# EAGLE schematic TwixBC_0.5 (EAGLE 5.06)

## Sheet 1 of 2
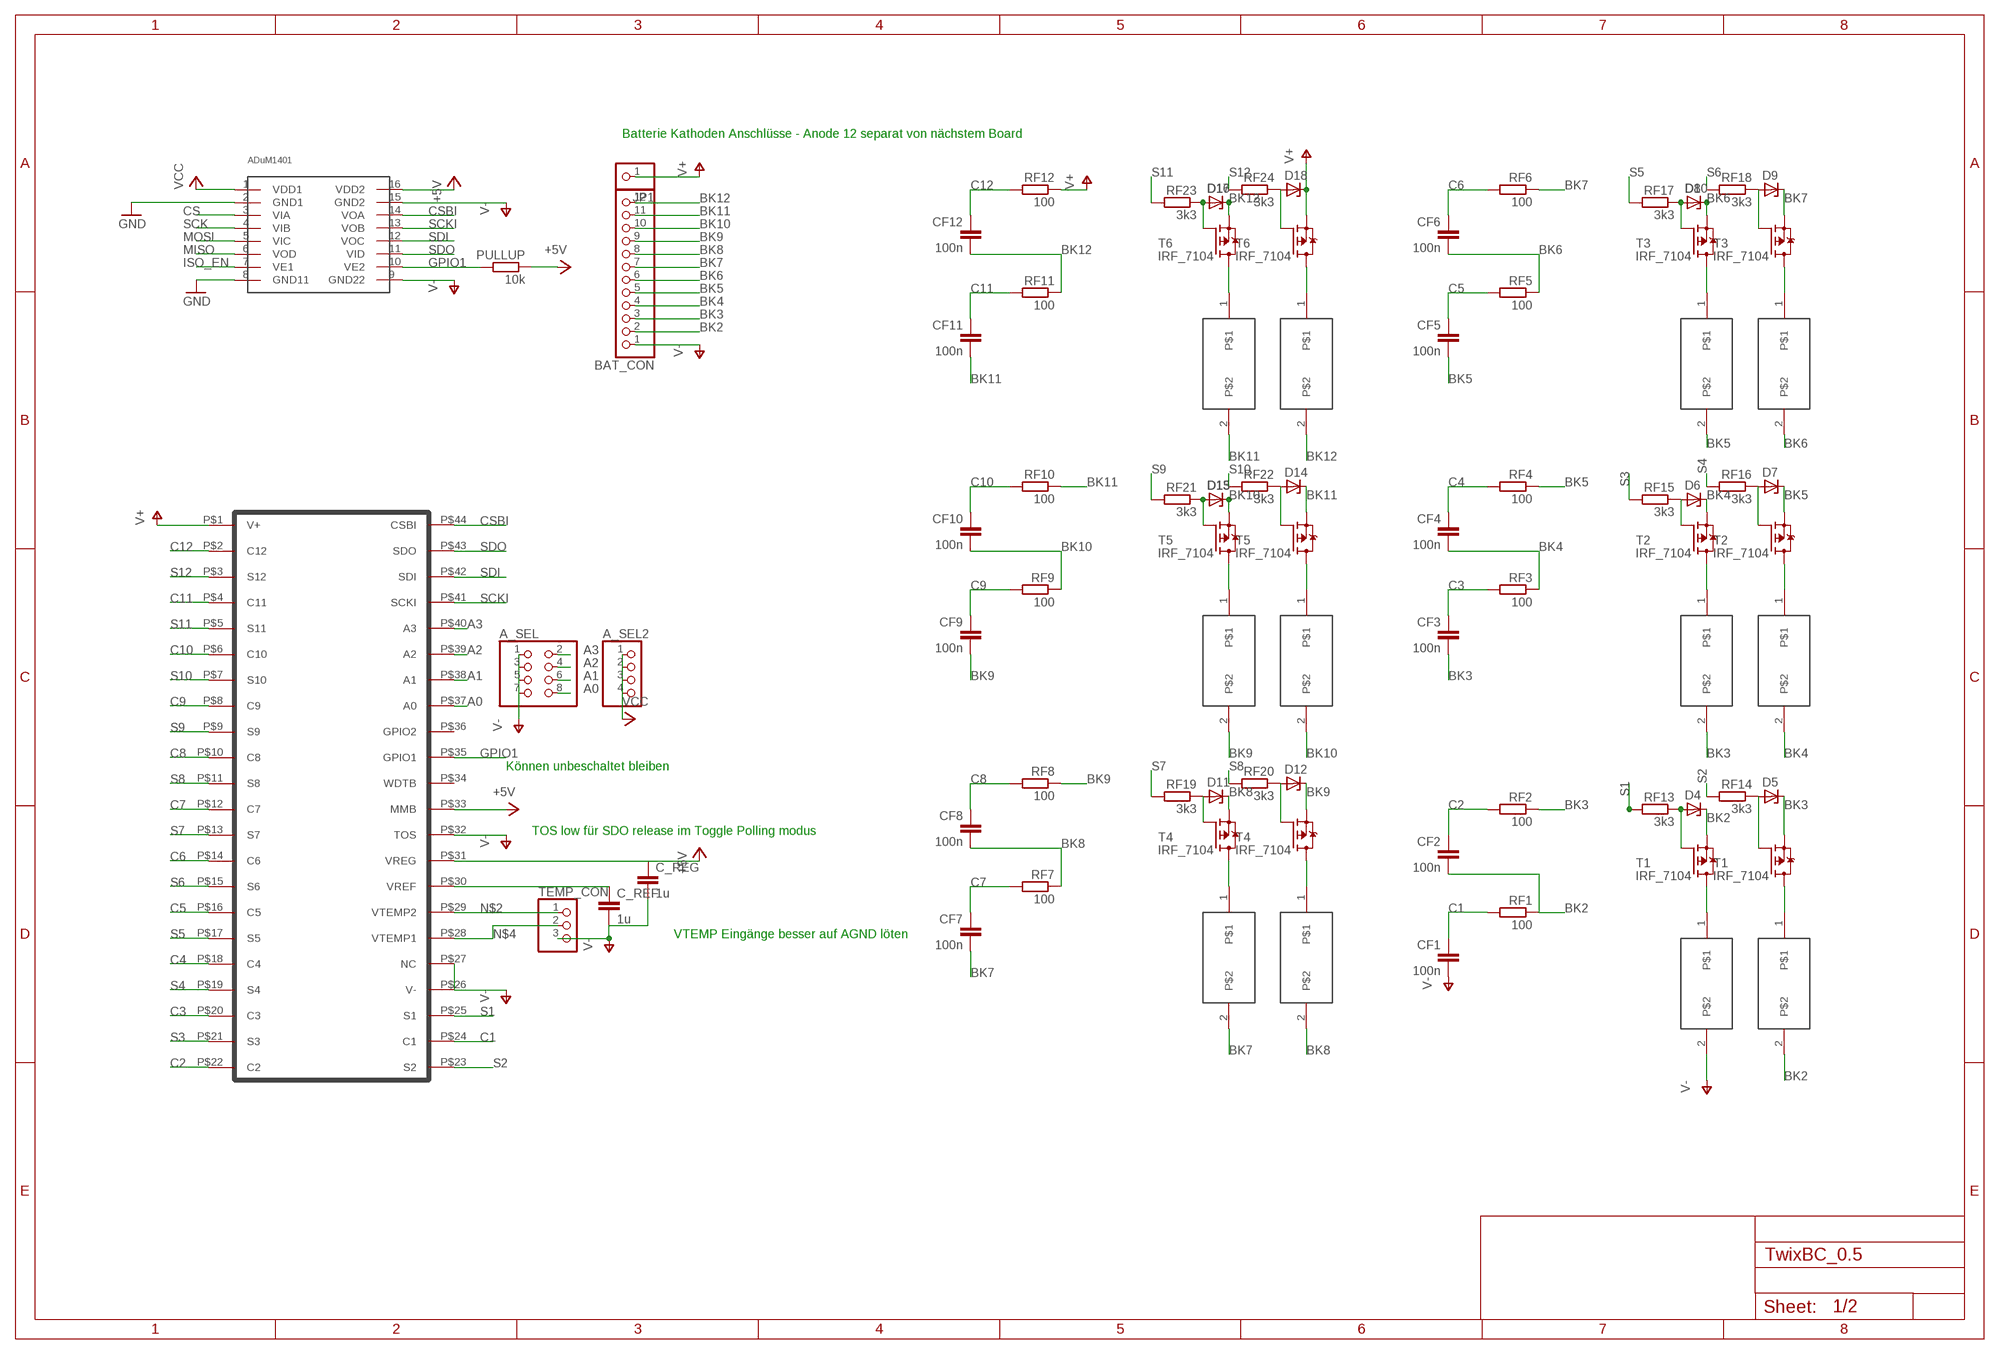
[diagram p0: schematic, sheet 1]

### Parts
A_SEL  PINHD-2X4  [2X04]
A_SEL2  PINHD-1X4  [1X04]
BAT_CON  PINHD-1X12  [1X12]
C_REF  1u  C-EUC1206  [C1206]
C_REG  1u  C-EUC1206  [C1206]
CF1  100n  C-EUC1206  [C1206]
CF2  100n  C-EUC1206  [C1206]
CF3  100n  C-EUC1206  [C1206]
CF4  100n  C-EUC1206  [C1206]
CF5  100n  C-EUC1206  [C1206]
CF6  100n  C-EUC1206  [C1206]
CF7  100n  C-EUC1206  [C1206]
CF8  100n  C-EUC1206  [C1206]
CF9  100n  C-EUC1206  [C1206]
CF10  100n  C-EUC1206  [C1206]
CF11  100n  C-EUC1206  [C1206]
CF12  100n  C-EUC1206  [C1206]
D4  ZENER-DIODESOD80C  [SOD80C]
D5  ZENER-DIODESOD80C  [SOD80C]
D6  ZENER-DIODESOD80C  [SOD80C]
D7  ZENER-DIODESOD80C  [SOD80C]
D8  ZENER-DIODESOD80C  [SOD80C]
D9  ZENER-DIODESOD80C  [SOD80C]
D10  ZENER-DIODESOD80C  [SOD80C]
D11  ZENER-DIODESOD80C  [SOD80C]
D12  ZENER-DIODESOD80C  [SOD80C]
D13  ZENER-DIODESOD80C  [SOD80C]
D14  ZENER-DIODESOD80C  [SOD80C]
D15  ZENER-DIODESOD80C  [SOD80C]
D16  ZENER-DIODESOD80C  [SOD80C]
D17  ZENER-DIODESOD80C  [SOD80C]
D18  ZENER-DIODESOD80C  [SOD80C]
JP1  PINHD-1X1  [1X01]
PULLUP  10k  R-EU_R1206  [R1206]
RF1  100  R-EU_R1206  [R1206]
RF2  100  R-EU_R1206  [R1206]
RF3  100  R-EU_R1206  [R1206]
RF4  100  R-EU_R1206  [R1206]
RF5  100  R-EU_R1206  [R1206]
RF6  100  R-EU_R1206  [R1206]
RF7  100  R-EU_R1206  [R1206]
RF8  100  R-EU_R1206  [R1206]
RF9  100  R-EU_R1206  [R1206]
RF10  100  R-EU_R1206  [R1206]
RF11  100  R-EU_R1206  [R1206]
RF12  100  R-EU_R1206  [R1206]
RF13  3k3  R-EU_R1206  [R1206]
RF14  3k3  R-EU_R1206  [R1206]
RF15  3k3  R-EU_R1206  [R1206]
RF16  3k3  R-EU_R1206  [R1206]
RF17  3k3  R-EU_R1206  [R1206]
RF18  3k3  R-EU_R1206  [R1206]
RF19  3k3  R-EU_R1206  [R1206]
RF20  3k3  R-EU_R1206  [R1206]
RF21  3k3  R-EU_R1206  [R1206]
RF22  3k3  R-EU_R1206  [R1206]
RF23  3k3  R-EU_R1206  [R1206]
RF24  3k3  R-EU_R1206  [R1206]
RL1  R_5W  [R_5W]
RL2  R_5W  [R_5W]
RL3  R_5W  [R_5W]
RL4  R_5W  [R_5W]
RL5  R_5W  [R_5W]
RL6  R_5W  [R_5W]
RL7  R_5W  [R_5W]
RL8  R_5W  [R_5W]
RL9  R_5W  [R_5W]
RL10  R_5W  [R_5W]
RL11  R_5W  [R_5W]
RL12  R_5W  [R_5W]
T1  IRF_7104  [SO8]
T2  IRF_7104  [SO8]
T3  IRF_7104  [SO8]
T4  IRF_7104  [SO8]
T5  IRF_7104  [SO8]
T6  IRF_7104  [SO8]
TEMP_CON  PINHD-1X3  [1X03]
U$1  LTC6802-2  [SSOP48]
U$3  ADUM1401  [SO16]

### Nets
+5V: C_REG.1 PULLUP.1 U$1.P$31(VREG) U$1.P$33(MMB) U$3.16(VDD2)
A0: A_SEL.8 U$1.P$37(A0)
A1: A_SEL.6 U$1.P$38(A1)
A2: A_SEL.4 U$1.P$39(A2)
A3: A_SEL.2 U$1.P$40(A3)
ASD: RL5.1 T3.7(D2)
BK2: BAT_CON.2 CF2.2 D4.C RF1.1 RL2.2 T1.1(S2)
BK3: BAT_CON.3 CF3.2 D5.C RF2.1 RL3.2 T1.3(S1)
BK4: BAT_CON.4 CF4.2 D6.C RF3.1 RL4.2 T2.1(S2)
BK5: BAT_CON.5 CF5.2 D7.C RF4.1 RL5.2 T2.3(S1)
BK6: BAT_CON.6 CF6.2 D8.C D10.C RF5.1 RL6.2 T3.1(S2)
BK7: BAT_CON.7 CF7.2 D9.C RF6.1 RL7.2 T3.3(S1)
BK8: BAT_CON.8 CF8.2 D11.C RF7.1 RL8.2 T4.1(S2)
BK9: BAT_CON.9 CF9.2 D12.C RF8.1 RL9.2 T4.3(S1)
BK10: BAT_CON.10 CF10.2 D13.C D15.C RF9.1 RL10.2 T5.1(S2)
BK11: BAT_CON.11 CF11.2 D14.C RF10.1 RL11.2 T5.3(S1)
BK12: BAT_CON.12 CF12.2 D16.C D17.C RF11.1 RL12.2 T6.1(S2)
C1: CF1.1 RF1.2 U$1.P$24(C1)
C2: CF2.1 RF2.2 U$1.P$22(C2)
C3: CF3.1 RF3.2 U$1.P$20(C3)
C4: CF4.1 RF4.2 U$1.P$18(C4)
C5: CF5.1 RF5.2 U$1.P$16(C5)
C6: CF6.1 RF6.2 U$1.P$14(C6)
C7: CF7.1 RF7.2 U$1.P$12(C7)
C8: CF8.1 RF8.2 U$1.P$10(C8)
C9: CF9.1 RF9.2 U$1.P$8(C9)
C10: CF10.1 RF10.2 U$1.P$6(C10)
C11: CF11.1 RF11.2 U$1.P$4(C11)
C12: CF12.1 RF12.2 U$1.P$2(C12)
CS: U$3.3(VIA) ; also sheet 2
CSBI: U$1.P$44(CSBI) U$3.14(VOA)
GND: U$3.2(GND1) U$3.8(GND11) ; also sheet 2
GPIO1: PULLUP.2 U$1.P$35(GPIO1) U$3.10(VE2)
ISO_EN: U$3.7(VE1) ; also sheet 2
MISO: U$3.6(VOD) ; also sheet 2
MOSI: U$3.5(VIC) ; also sheet 2
N$2: TEMP_CON.1 U$1.P$29(VTEMP2)
N$3: C_REF.1 U$1.P$30(VREF)
N$4: TEMP_CON.2 U$1.P$28(VTEMP1)
N$5: RL3.1 T2.7(D2)
N$6: RL4.1 T2.5(D1)
N$8: RL1.1 T1.7(D2)
N$9: RL2.1 T1.5(D1)
N$10: RL6.1 T3.5(D1)
N$11: RL7.1 T4.7(D2)
N$12: RL8.1 T4.5(D1)
N$13: RL9.1 T5.7(D2)
N$14: RL10.1 T5.5(D1)
N$15: RL11.1 T6.7(D2)
N$16: RL12.1 T6.5(D1)
N$17: D4.A RF13.1 T1.2(G2)
N$23: D5.A RF14.1 T1.4(G1)
N$55: D6.A RF15.1 T2.2(G2)
N$56: D7.A RF16.1 T2.4(G1)
N$57: D8.A D10.A RF17.1 T3.2(G2)
N$58: D11.A RF19.1 T4.2(G2)
N$59: D9.A RF18.1 T3.4(G1)
N$60: D12.A RF20.1 T4.4(G1)
N$61: D13.A D15.A RF21.1 T5.2(G2)
N$62: D14.A RF22.1 T5.4(G1)
N$63: D16.A D17.A RF23.1 T6.2(G2)
N$64: D18.A RF24.1 T6.4(G1)
S1: RF13.2 U$1.P$25(S1)
S2: RF14.2 U$1.P$23(S2)
S3: RF15.2 U$1.P$21(S3)
S4: RF16.2 U$1.P$19(S4)
S5: RF17.2 U$1.P$17(S5)
S6: RF18.2 U$1.P$15(S6)
S7: RF19.2 U$1.P$13(S7)
S8: RF20.2 U$1.P$11(S8)
S9: RF21.2 U$1.P$9(S9)
S10: RF22.2 U$1.P$7(S10)
S11: RF23.2 U$1.P$5(S11)
S12: RF24.2 U$1.P$3(S12)
SCK: U$3.4(VIB) ; also sheet 2
SCKI: U$1.P$41(SCKI) U$3.13(VOB)
SDI: U$1.P$42(SDI) U$3.12(VOC)
SDO: U$1.P$43(SDO) U$3.11(VID)
V+: D18.C JP1.1 RF12.1 T6.3(S1) U$1.P$1(V+)
V-: A_SEL.1 A_SEL.3 A_SEL.5 A_SEL.7 BAT_CON.1 C_REF.2 C_REG.2 CF1.2 RL1.2 TEMP_CON.3 U$1.P$26(V-) U$1.P$27(NC) U$1.P$32(TOS) U$3.9(GND22) U$3.15(GND2)
VCC: A_SEL2.1 A_SEL2.2 A_SEL2.3 A_SEL2.4 U$3.1(VDD1) ; also sheet 2
Unconnected: U$1.P$34(WDTB) U$1.P$36(GPIO2)

### Notes on the sheet
- Batterie Kathoden Anschlüsse - Anode 12 separat von nächstem Board
- Können unbeschaltet bleiben
- TOS low für SDO release im Toggle Polling modus
- VTEMP Eingänge besser auf AGND löten

## Sheet 2 of 2
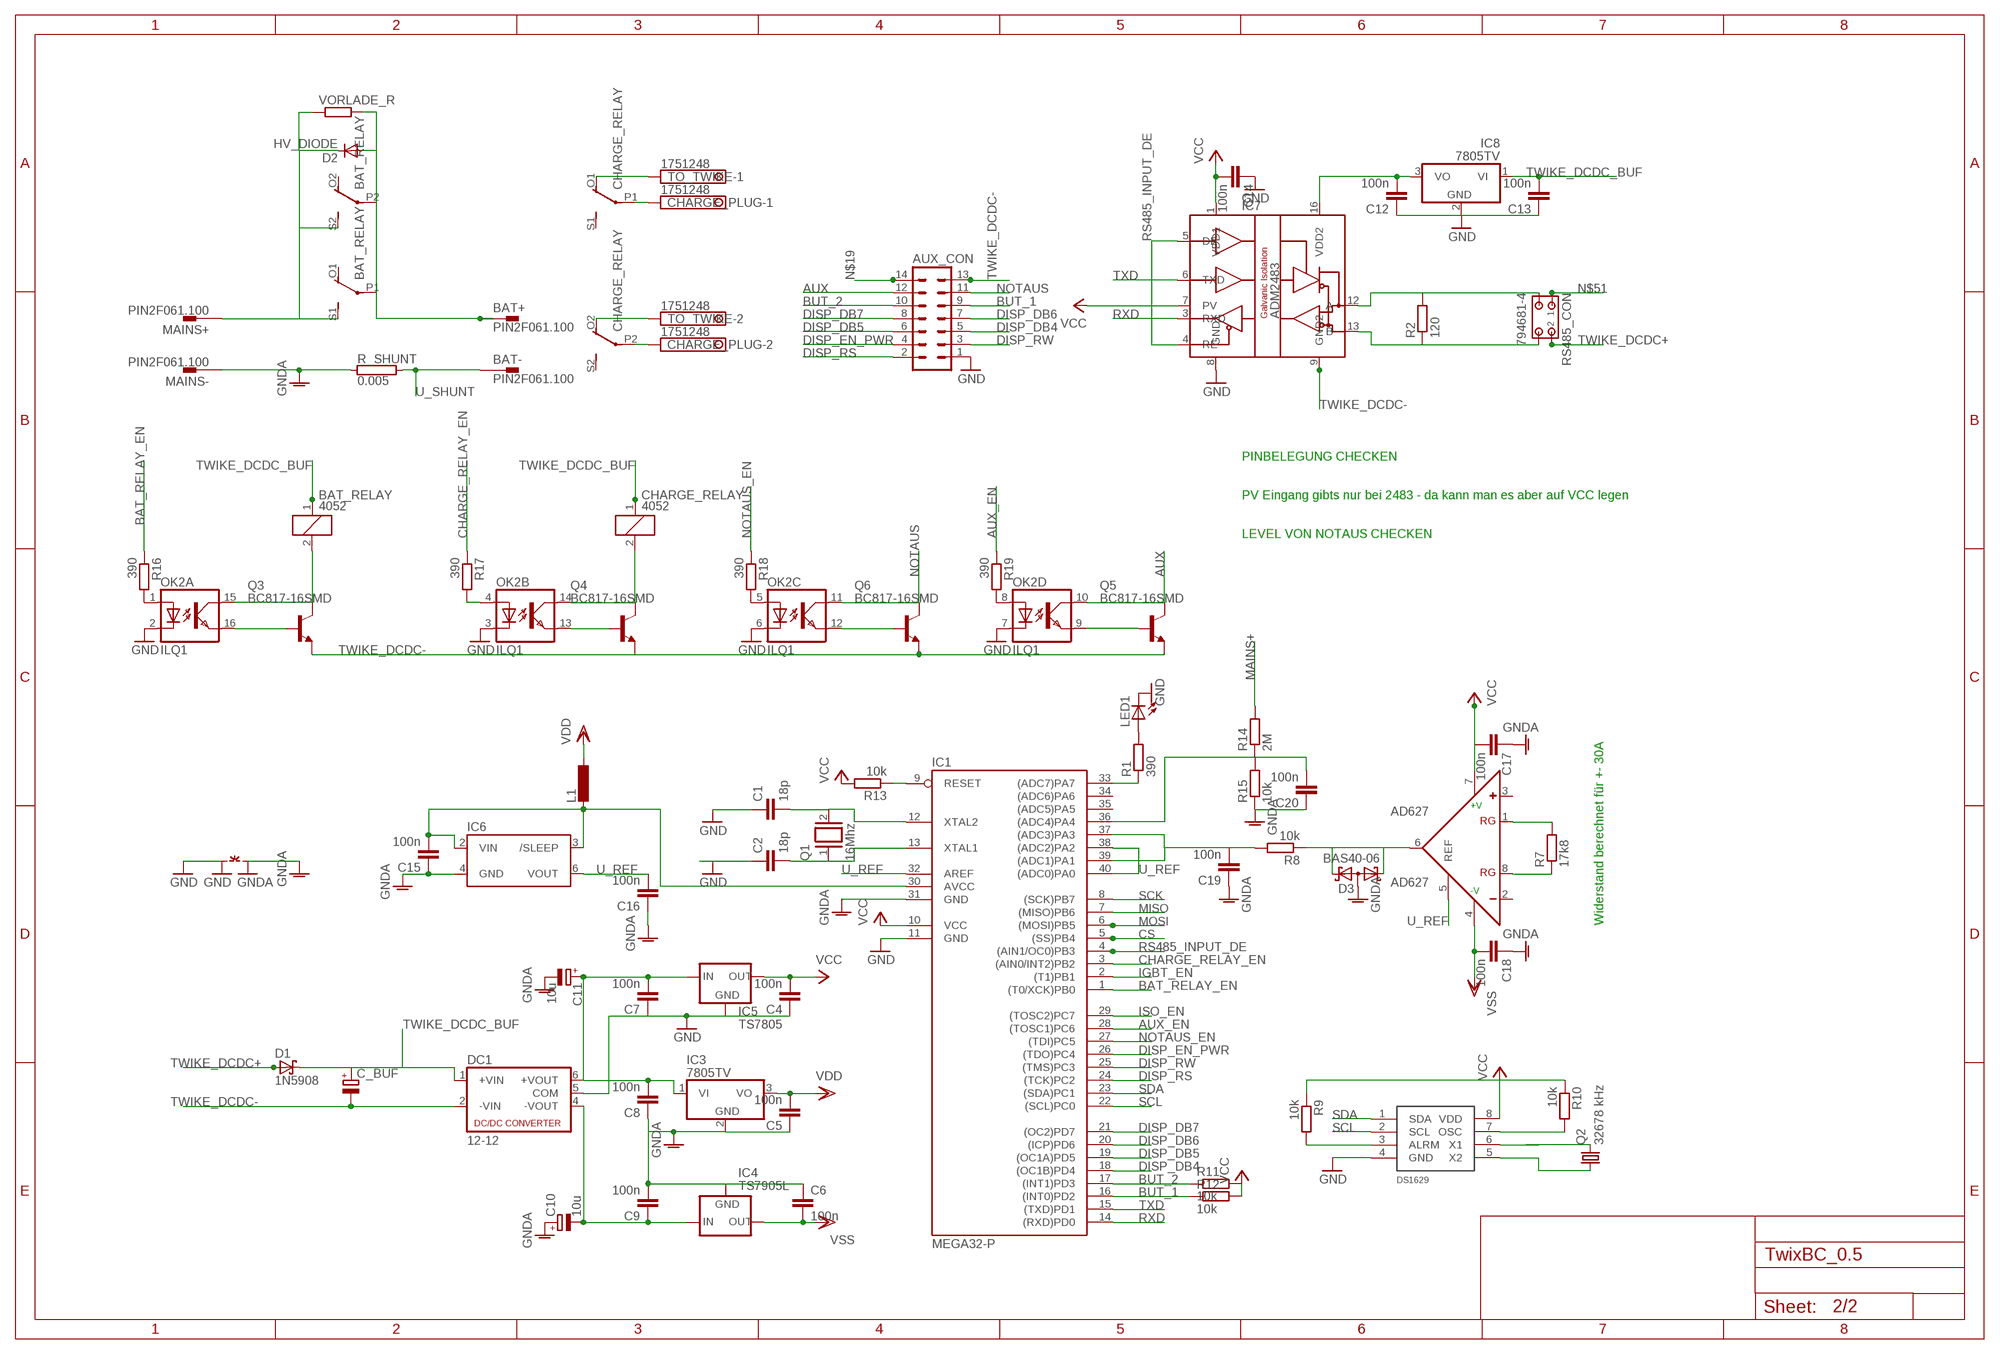
[diagram p1: schematic, sheet 2]

### Parts
AD627  AD627  AD620N  [DIL08]
AUX_CON  ML14  [ML14]
BAT+  PIN2F061.100  [F061.100]
BAT-  PIN2F061.100  [F061.100]
BAT_RELAY  4052  [F4052]
C1  18p  C-EUC1206  [C1206]
C2  18p  C-EUC1206  [C1206]
C4  100n  C-EUC1206  [C1206]
C5  100n  C-EUC1206  [C1206]
C6  100n  C-EUC1206  [C1206]
C7  100n  C-EUC1206  [C1206]
C8  100n  C-EUC1206  [C1206]
C9  100n  C-EUC1206  [C1206]
C10  10u  CPOL-EUE2.5-5  [E2,5-5]
C11  10u  CPOL-EUE2.5-5  [E2,5-5]
C12  100n  C-EUC1206  [C1206]
C13  100n  C-EUC1206  [C1206]
C14  100n  C-EUC1206  [C1206]
C15  100n  C-EUC1206  [C1206]
C16  100n  C-EUC1206  [C1206]
C17  100n  C-EUC1206  [C1206]
C18  100n  C-EUC1206  [C1206]
C19  100n  C-EUC1206  [C1206]
C20  100n  C-EUC1206  [C1206]
C_BUF  CPOL-EUE7.5-18  [E7,5-18]
CHARGE_PLUG  1751248  [1751248]
CHARGE_RELAY  4052  [F4052]
D1  1N5908  [C4111-15]
D2  HV_DIODE  UF5400  [DO201-15]
D3  BAS40-06  [SOT23]
DC1  12-12  NMA  [NMA]
IC1  MEGA32-P  [DIL40]
IC3  7805TV  [TO220V]
IC4  TS7905L  79XXL  [79XXL]
IC5  TS7805  78XXS  [78XXS]
IC6  REF192  [SO08]
IC7  ADM2483  [SO16W]
IC8  7805TV  [TO220V]
L1  L-EUL3225M  [L3225M]
LED1  LEDCHIP-LED0805  [CHIP-LED0805]
MAINS+  PIN2F061.100  [F061.100]
MAINS-  PIN2F061.100  [F061.100]
OK2  ILQ1  [DIL16]
Q1  16Mhz  XTAL  [Q]
Q2  32678 kHz  CRYSTALTC26V  [TC26V]
Q3  BC817-16SMD  [SOT23-BEC]
Q4  BC817-16SMD  [SOT23-BEC]
Q5  BC817-16SMD  [SOT23-BEC]
Q6  BC817-16SMD  [SOT23-BEC]
R1  390  R-EU_M1206  [M1206]
R2  120  R-EU_M1206  [M1206]
R7  17k8  R-EU_M1206  [M1206]
R8  10k  R-EU_M1206  [M1206]
R9  10k  R-EU_M1206  [M1206]
R10  10k  R-EU_M1206  [M1206]
R11  10k  R-EU_M1206  [M1206]
R12  10k  R-EU_M1206  [M1206]
R13  10k  R-EU_M1206  [M1206]
R14  2M  R-EU_MELF0207W  [MINI_MELF-0207W]
R15  10k  R-EU_MELF0207W  [MINI_MELF-0207W]
R16  390  R-EU_M1206  [M1206]
R17  390  R-EU_M1206  [M1206]
R18  390  R-EU_M1206  [M1206]
R19  390  R-EU_M1206  [M1206]
R_SHUNT  0.005  RKH208-8  [KH208-8]
RS485_CON  794681-4  [794681-4]
TO_TWIKE  1751248  [1751248]
U$2  DS1629  [S08]
VORLADE_R  R-EU_RDH/15  [RDH/15]
~NUDEV~1  GND-GNDA  [GND-GNDA]

### Nets
AUX: AUX_CON.12 OK2.10(D:COL) Q5.C
AUX_EN: IC1.28((TOSC1)PC6) R19.1
BAT_RELAY_EN: IC1.1((T0/XCK)PB0) R16.1
BUT_1: AUX_CON.9 IC1.16((INT0)PD2) R12.1
BUT_2: AUX_CON.10 IC1.17((INT1)PD3) R11.1
CHARGE_RELAY_EN: IC1.3((AIN0/INT2)PB2) R17.1
CS: IC1.5((SS)PB4) ; also sheet 1
DISP_DB4: AUX_CON.5 IC1.18((OC1B)PD4)
DISP_DB5: AUX_CON.6 IC1.19((OC1A)PD5)
DISP_DB6: AUX_CON.7 IC1.20((ICP)PD6)
DISP_DB7: AUX_CON.8 IC1.21((OC2)PD7)
DISP_EN_PWR: AUX_CON.4 IC1.26((TDO)PC4)
DISP_RS: AUX_CON.2 IC1.24((TCK)PC2)
DISP_RW: AUX_CON.3 IC1.25((TMS)PC3)
GND: AUX_CON.1 C1.1 C4.1 C7.1 C12.1 C13.1 C14.1 DC1.5(COM) IC1.11(GND) IC5.GND IC7.8(GND1) IC8.2(GND) LED1.C OK2.2(A:C) OK2.3(B:C) OK2.6(C:C) OK2.7(D:C) U$2.4(GND) ~NUDEV~1.GND ; also sheet 1
GNDA: C5.1 C6.1 C8.1 C9.2 C10.+ C11.- C15.1 C16.1 C17.1 C18.1 C19.1 C20.1 D3.3(AA) IC1.31(GND) IC3.2(GND) IC4.GND IC6.4(GND) MAINS-.A1 R15.1 R_SHUNT.1 ~NUDEV~1.GNDA
IGBT_EN: IC1.2((T1)PB1)
ISO_EN: IC1.29((TOSC2)PC7) ; also sheet 1
MAINS+: BAT_RELAY.S1(2:S) BAT_RELAY.S2(3:S) D2.C MAINS+.A1 R14.2 VORLADE_R.1
MISO: IC1.7((MISO)PB6) ; also sheet 1
MOSI: IC1.6((MOSI)PB5) ; also sheet 1
N$1: IC1.33((ADC7)PA7) R1.1
N$7: C2.1
N$18: C1.2 IC1.12(XTAL2) Q1.2
N$19: AUX_CON.14
N$22: C2.2 IC1.13(XTAL1) Q1.1
N$24: BAT+.A1 BAT+.A2(1.1) BAT_RELAY.P1(2:P) BAT_RELAY.P2(3:P) D2.A VORLADE_R.2
N$25: BAT_RELAY.2 OK2.15(A:COL) Q3.C
N$26: IC7.12(A) R2.2 RS485_CON.3
N$27: IC7.13(B) R2.1 RS485_CON.4
N$28: C12.2 IC7.16(VDD2) IC8.3(VO)
N$29: C15.2 IC1.30(AVCC) IC6.2(VIN) IC6.3(/SLEEP) L1.2
N$30: AD627.6(OUT) D3.1(K1) D3.2(K2) R8.1
N$31: C7.2 C8.2 C11.+ DC1.6(+VOUT) IC3.1(VI) IC5.IN
N$32: C9.1 C10.- DC1.4(-VOUT) IC4.IN
N$33: AD627.1(RG) R7.2
N$34: AD627.8(RG) R7.1
N$35: C19.2 IC1.37((ADC3)PA3) IC1.39((ADC1)PA1) R8.2
N$36: R10.2 U$2.7(OSC)
N$37: R9.2 U$2.3(ALRM)
N$38: IC1.9(RESET) R13.1
N$39: C20.2 IC1.36((ADC4)PA4) R14.1 R15.2
N$40: Q2.2 U$2.6(X1)
N$41: Q2.1 U$2.5(X2)
N$42: OK2.16(A:EMIT) Q3.B
N$43: OK2.1(A:A) R16.2
N$44: OK2.4(B:A) R17.2
N$45: CHARGE_PLUG.1 CHARGE_RELAY.P1(2:P)
N$46: CHARGE_PLUG.2 CHARGE_RELAY.P2(3:P)
N$47: CHARGE_RELAY.2 OK2.14(B:COL) Q4.C
N$48: CHARGE_RELAY.O1(2:O) TO_TWIKE.1
N$49: CHARGE_RELAY.O2(3:O) TO_TWIKE.2
N$50: OK2.5(C:A) R18.2
N$51: RS485_CON.1
N$52: OK2.8(D:A) R19.2
N$53: LED1.A R1.2
N$54: OK2.9(D:EMIT) Q5.B
N$65: OK2.12(C:EMIT) Q6.B
NOTAUS: AUX_CON.11 OK2.11(C:COL) Q6.C
NOTAUS_EN: IC1.27((TDI)PC5) R18.1
RS485_INPUT_DE: IC1.4((AIN1/OC0)PB3) IC7.4(RE) IC7.5(DE)
RXD: IC1.14((RXD)PD0) IC7.3(RXD)
SCK: IC1.8((SCK)PB7) ; also sheet 1
SCL: IC1.22((SCL)PC0) U$2.2(SCL)
SDA: IC1.23((SDA)PC1) U$2.1(SDA)
TWIKE_DCDC+: D1.A RS485_CON.2
TWIKE_DCDC-: AUX_CON.13 C_BUF.- DC1.2(-VIN) IC7.9(GND2) OK2.13(B:EMIT) Q3.E Q4.B Q4.E Q5.E Q6.E
TWIKE_DCDC_BUF: BAT_RELAY.1 C13.2 C_BUF.+ CHARGE_RELAY.1 D1.C DC1.1(+VIN) IC8.1(VI)
TXD: IC1.15((TXD)PD1) IC7.6(TXD)
U_REF: AD627.5(REF) C16.2 IC1.32(AREF) IC1.38((ADC2)PA2) IC1.40((ADC0)PA0) IC6.6(VOUT)
U_SHUNT: BAT-.A1 R_SHUNT.2
VCC: AD627.7(+V) C4.2 C14.2 C17.2 IC1.10(VCC) IC5.OUT IC7.1(VDD1) IC7.7(PV) R9.1 R10.1 R11.2 R12.2 R13.2 U$2.8(VDD) ; also sheet 1
VDD: C5.2 IC3.3(VO) L1.1
VSS: AD627.4(-V) C6.2 C18.2 IC4.OUT
Unconnected: AD627.2(-) AD627.3(+) BAT-.A2(1.1) BAT_RELAY.O1(2:O) BAT_RELAY.O2(3:O) CHARGE_RELAY.S1(2:S) CHARGE_RELAY.S2(3:S) IC1.34((ADC6)PA6) IC1.35((ADC5)PA5) MAINS+.A2(1.1) MAINS-.A2(1.1)

### Notes on the sheet
- PINBELEGUNG CHECKEN
- PV Eingang gibts nur bei 2483 - da kann man es aber auf VCC legen
- LEVEL VON NOTAUS CHECKEN
- Widerstand berechnet für +- 30A

## Library data of the parts
A_SEL = pinhead:PINHD-2X4: PIN HEADER
A_SEL2 = pinhead:PINHD-1X4: PIN HEADER
AD627 = analog-devices:AD620: Low Cost, Low Power, Instrumentation Amplifier Source: http://www.analog.com/UploadedFiles/Data_Sheets/37793330023930AD620_e.pdf
AUX_CON = con-ml:ML14: HARTING
BAT+ BAT- MAINS+ MAINS- = con-faston:PIN2: Flachstecker Typ Tyco/Electronics/AMP TAB, FASTON Printed Circuit Board Tabs Source: http://www.buerklin.com, http://catalog.tycoelectronics.com
BAT_CON = pinhead:PINHD-1X12: PIN HEADER
BAT_RELAY CHARGE_RELAY = relay:4052: RELAY 2 x switch, Finder
C1 C2 C4-C9 C12-C20 C_REF C_REG CF1-CF12 = rcl:C-EU: CAPACITOR, European symbol
C10 C11 C_BUF = rcl:CPOL-EU: POLARIZED CAPACITOR, European symbol
CHARGE_PLUG TO_TWIKE = con-phoenix-350:1751248: MKDS 1/ 2-3,5 Printklemme Nennstrom: 10 A Bemessungsspannung: 160 V Raster: 3,5 mm Polzahl: 2 Montageart: Löten Anschlussart: Schraubanschluss Anschlussrichtung vom Leiter zur Platine: 0° Source: http://eshop.phoenixcontact.com .. 1751248.pdf
D1 = diode:1N5908: DIODE schottky
D2 = diode:UF5400: DIODE ultra fast rectifier, 3 A
D3 = diode:BAS40-06: Silicon Schottky Diodes General-purpose diode for high-speed switching
D4-D18 = diode:ZENER-DIODE: Z-Diode
DC1 = dc-dc-converter:NMA: DC-DC CONVERTER
IC1 = atmel:MEGA32-P: MICROCONTROLLER 32 Kbytes FLASH 2 Kbytes SRAM 1 Kbytes EEPROM USART 8-channel 10 bit ADC Source: www.atmel.com .. doc2503.pdf
IC3 IC8 = linear:78*: Positive VOLTAGE REGULATOR Source: http://cache.national.com/ds/LM/LM78L05.pdf http://www.fairchildsemi.com/ds/LM/LM7805.pdf
IC4 = v-reg:79XXL: VOLTAGE REGULATOR
IC5 = v-reg:78XXS: VOLTAGE REGULATOR
IC6 = Libs_Markus:REF192
IC7 = Libs_Markus:ADM2483: RS-485 Transceiver, iCoupler® Isolated, Half-Duplex
JP1 = pinhead:PINHD-1X1: PIN HEADER
L1 = rcl:L-EU: INDUCTOR, European symbol
LED1 = led:LED: LED OSRAM: - CHIPLED LG R971, LG N971, LY N971, LG Q971, LY Q971, LO R971, LY R971 LH N974, LH R974 LS Q976, LO Q976, LY Q976 LO Q996 - Hyper CHIPLED LW Q18S LB Q993, LB Q99A, LB R99A - SideLED LS A670, LO A670, LY A670, LG A670, LP A670 LB A673, LV A673, LT A673, LW A673 LH A674 LY A675 LS A676, LA A676, LO A676, LY A676, LW A676 LS A679, LY A679, LG A679 - Hyper Micro SIDELED® LS Y876, LA Y876, LO Y876, LY Y876 LT Y87S - SmartLED LW L88C, LW L88S LB L89C, LB L89S, LG L890 LS L89K, LO L89K, LY L89K LS L896, LA L896, LO L896, LY L896 - TOPLED LS T670, LO T670, LY T670, LG T670, LP T670 LSG T670, LSP T670, LSY T670, LOP T670, LYG T670 LG T671, LOG T671, LSG T671 LB T673, LV T673, LT T673, LW T673 LH T674 LS T676, LA T676, LO T676, LY T676, LB T676, LH T676, LSB T676, LW T676 LB T67C, LV T67C, LT T67C, LS T67K, LO T67K, LY T67K, LW E67C LS E67B, LA E67B, LO E67B, LY E67B, LB E67C, LV E67C, LT E67C LW T67C LS T679, LY T679, LG T679 LS T770, LO T770, LY T770, LG T770, LP T770 LB T773, LV T773, LT T773, LW T773 LH T774 LS E675, LA E675, LY E675, LS T675 LS T776, LA T776, LO T776, LY T776, LB T776 LHGB T686 LT T68C, LB T68C - Hyper Mini TOPLED® LB M676 - Mini TOPLED Santana® LG M470 LS M47K, LO M47K, LY M47K Source: http://www.osram.convergy.de LUXEON: - LUMILED® LXK2-PW12-R00, LXK2-PW12-S00, LXK2-PW14-U00, LXK2-PW14-V00 LXK2-PM12-R00, LXK2-PM12-S00, LXK2-PM14-U00 LXK2-PE12-Q00, LXK2-PE12-R00, LXK2-PE12-S00, LXK2-PE14-T00, LXK2-PE14-U00 LXK2-PB12-K00, LXK2-PB12-L00, LXK2-PB12-M00, LXK2-PB14-N00, LXK2-PB14-P00, LXK2-PB14-Q00 LXK2-PR12-L00, LXK2-PR12-M00, LXK2-PR14-Q00, LXK2-PR14-R00 LXK2-PD12-Q00, LXK2-PD12-R00, LXK2-PD12-S00 LXK2-PH12-R00, LXK2-PH12-S00 LXK2-PL12-P00, LXK2-PL12-Q00, LXK2-PL12-R00 Source: www.luxeon.com KINGBRIGHT: KA-3528ASYC Source: www.kingbright.com
OK2 = optocoupler:ILQ1: SIEMENS OPTO COUPLER
PULLUP R1 R2 R7-R13 R16-R19 RF1-RF24 VORLADE_R = rcl:R-EU_: RESISTOR, European symbol
Q1 = special:XTAL: CRYSTAL
Q2 = crystal:CRYSTAL: CRYSTAL
Q3-Q6 = transistor-npn:BC817*: NPN Transistor
R14 R15 = resistor:R-EU_: RESISTOR, European symbol
R_SHUNT = resistor-power:R: Power Resitor
RL1-RL12 = R_Power:R_5W
RS485_CON = con-amp:794681-4: Micro MATE-N-LOK Connectors grid 1.5mm Dual Row Through Hole Vertical Metal Through Hole Holddowns Source: ENG_CD_794681_E.pdf
T1-T6 = IRF_7104:IRF_7104
TEMP_CON = pinhead:PINHD-1X3: PIN HEADER
U$1 = LTC6802:LTC6802-2
U$2 = DS1629:DS1629
U$3 = ADuM1401:ADUM1401
~NUDEV~1 = supply1:GND-GNDA: Example of GND--GNDA NET-Connetor for more info see description in package